# EAGLE board TEPIAmainboard (EAGLE 8.0.1), part 1 of 2
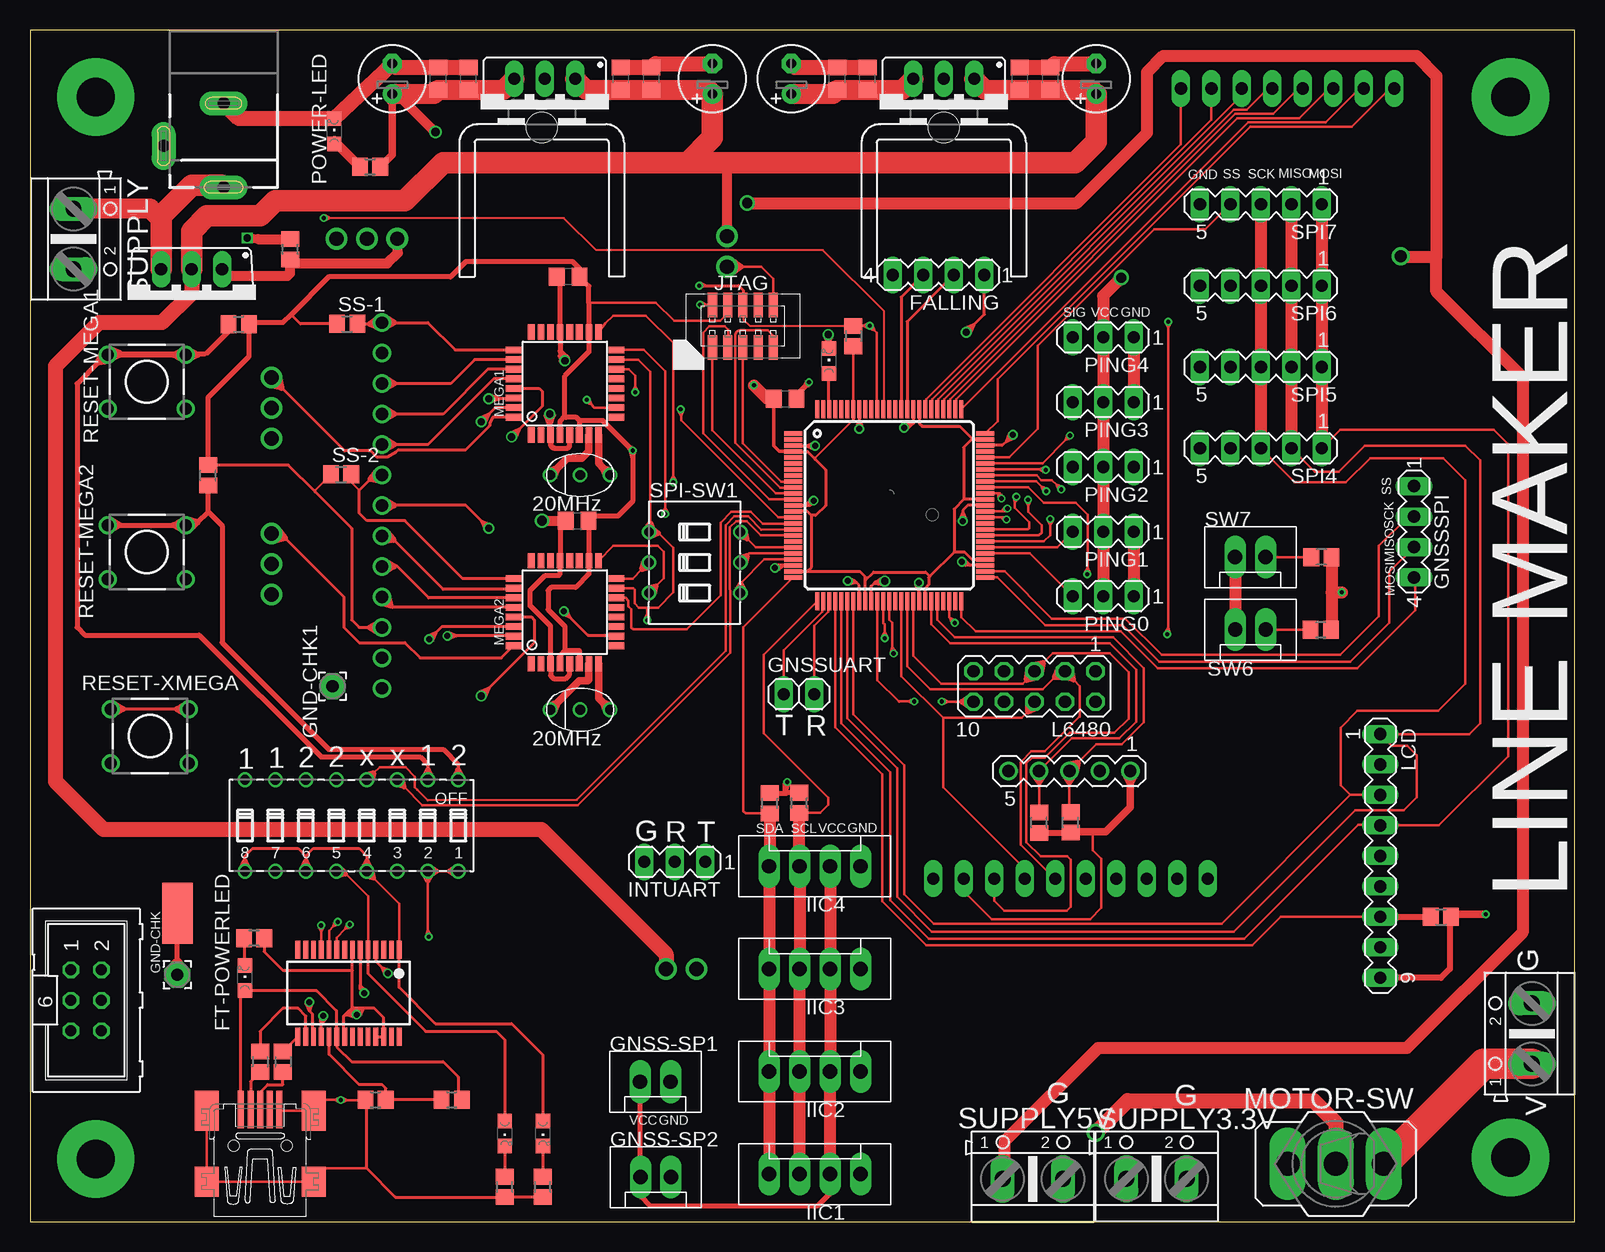
[diagram p5: board, top side]
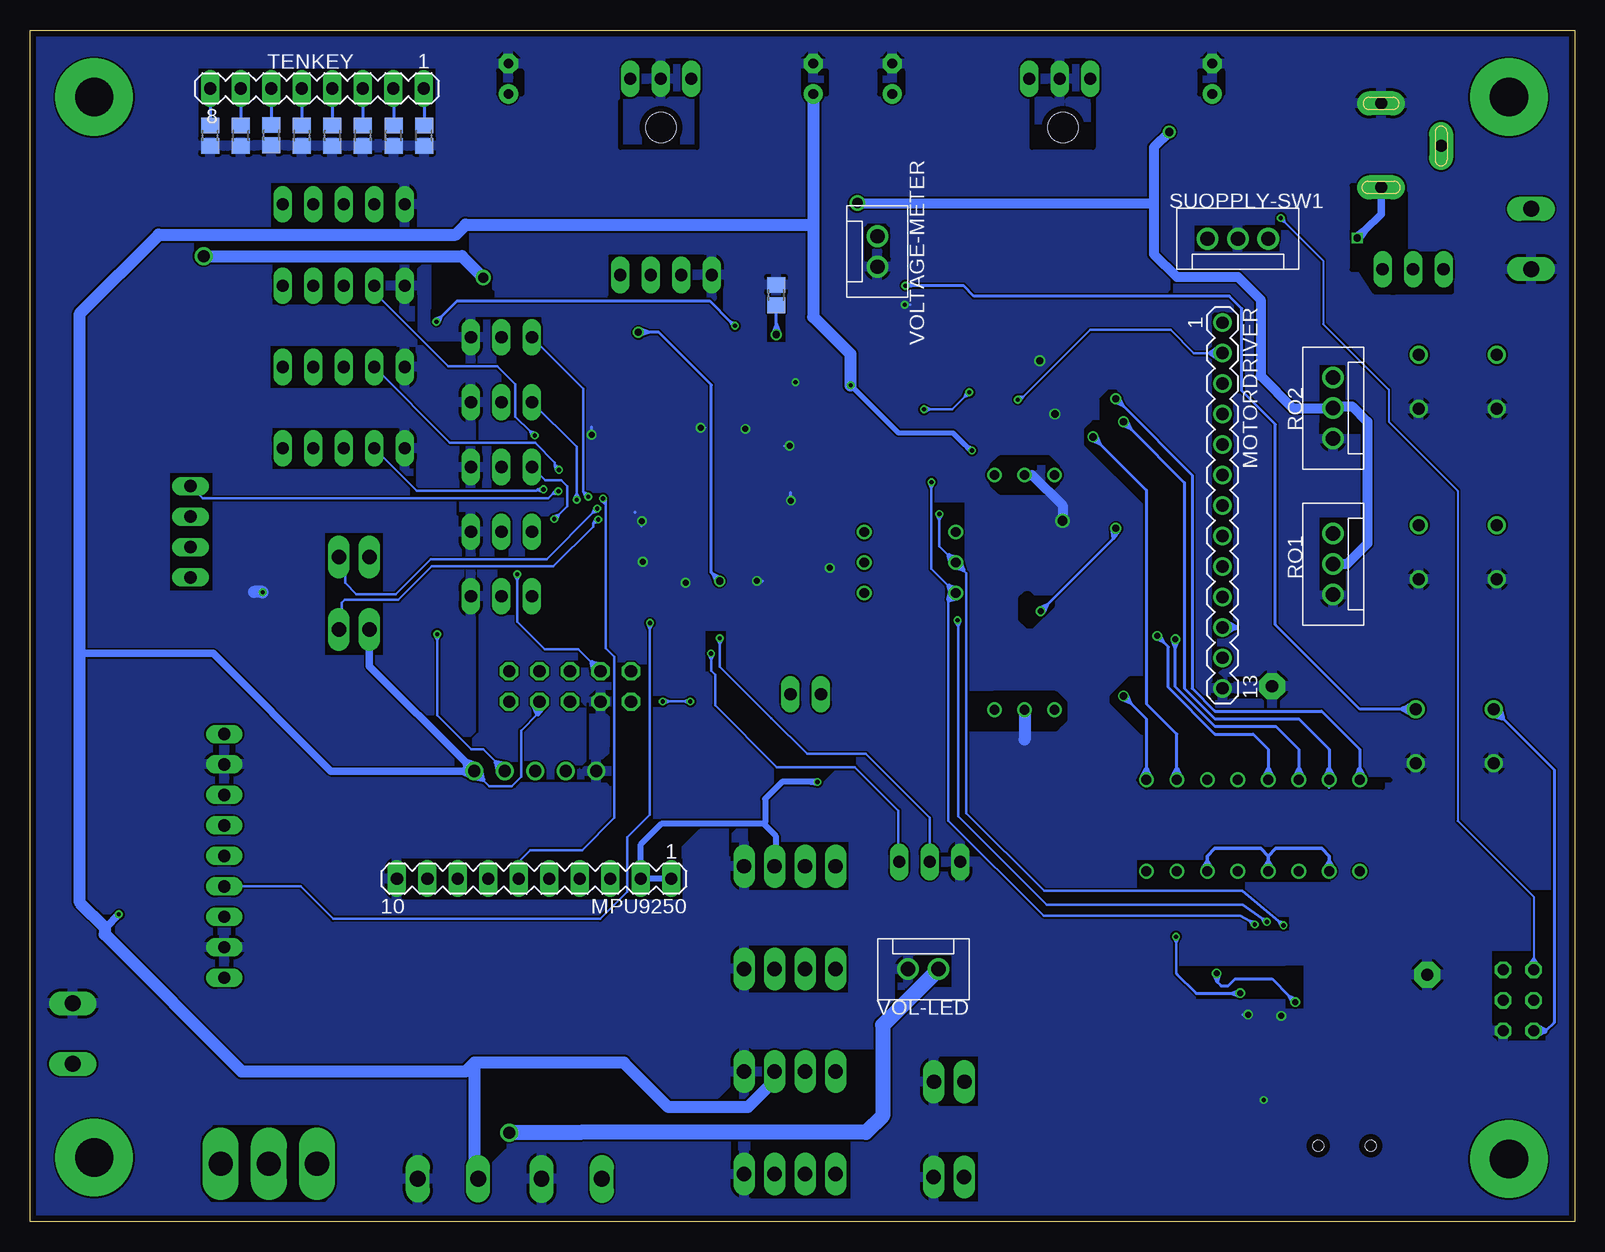
[diagram p6: board, bottom side, seen from below]

Size 128.72 x 99.31 mm. Coordinates in mm from the lower left corner, seen from the top.
Outline: 0,0 128.72,0 128.72,99.31 0,99.31 0,0
Copper layers (1*16): Top 0.035mm / dielectric 1.6mm / Bottom 0.035mm
Design rules "Elecrow_2-layer_PCB_eagle_rule": minimum track width 6mil, minimum drill 12mil, track to track 6mil, track to pad 6mil, pad to pad 6mil, via to via 8mil, smd to smd 0mil, copper to edge 20mil, drill to drill 10mil, minimum pad ring 6mil, minimum via ring 6mil, stop-mask expansion 0mil, vias tented up to drill 100mil, thermal gap 10mil
bRestrict: area 17.7,65.7 to 19.4,66.6; area 17.7,65.7 to 21.3,66.6; area 19.2,66.7 to 21.2,71.2; area 19.2,71.2 to 21.2,71.3; area 19.1,68.4 to 19.4,71.3; area 19.2,70.9 to 21.2,71.4; area 22.6,17.8 to 24.1,21.3; area 20.3,28.3 to 30.7,30.5; area 28.7,80.9 to 31.7,83; area 24.6,80.9 to 27.5,83.1; area 24.4,43.7 to 24.9,45.2; area 26.4,45.1 to 28.6,45.4; 33 more areas; 173 lines

## Footprints (pad centres in the part's own frame; a part is rotated, then mirrored left to right if it is on the bottom)
E2,5-6 = drill 0.813 pad 1.6: + -1.27,0 | drill 0.813 pad 1.6 octagon: - 1.27,0
C0805 = smd 1.3 x 1.5: 1 -0.95,0; 2 0.95,0
78XXS = drill 1.016 long: GND 0,-2.54; IN -2.54,-2.54; OUT 2.54,-2.54
MA04-1 = drill 1.016 long: 1 -3.81,0; 2 -1.27,0; 3 1.27,0; 4 3.81,0
R0805 = smd 1.3 x 1.5: 1 -0.85,0; 2 0.85,0
32005-201 = smd 3.1 x 0.5: 1 3,1.6; 2 3,0.8; 3 3,0; 4 3,-0.8; 5 3,-1.6 | smd 2.5 x 2: M1 -3,-4.45; M2 -3,4.45 | smd 3.3 x 2: M3 2.9,4.45; M4 2.9,-4.45 | hole 0.9: 0,2.2; 0,-2.2
CHIPLED_0805 = smd 1.2 x 1.2: A 0,-1.05; C 0,1.05
2,15/1,0 = drill 1.016 pad 2.159 octagon: 1 0,0
CON2 = drill 1.2 long: P$1 -1.27,0; P$2 1.27,0
1X02 = drill 1.016 long: 1 -1.27,0; 2 1.27,0
SSOP28 = smd 0.4 x 1.5: 1 -4.225,-3.625; 2 -3.575,-3.625; 3 -2.925,-3.625; 4 -2.275,-3.625; 5 -1.625,-3.625; 6 -0.975,-3.625; 7 -0.325,-3.625; 8 0.325,-3.625; 9 0.975,-3.625; 10 1.625,-3.625; 11 2.275,-3.625; 12 2.925,-3.625; 13 3.575,-3.625; 14 4.225,-3.625; 15 4.225,3.625; 16 3.575,3.625; 17 2.925,3.625; 18 2.275,3.625; 19 1.625,3.625; 20 0.975,3.625; 21 0.325,3.625; 22 -0.325,3.625; 23 -0.975,3.625; 24 -1.625,3.625; 25 -2.275,3.625; 26 -2.925,3.625; 27 -3.575,3.625; 28 -4.225,3.625
CON4 = drill 1.2 long: P$1 -3.81,0; P$2 -1.27,0; P$3 1.27,0; P$4 3.81,0
MA03-1 = drill 1.016 long: 1 -2.54,0; 2 0,0; 3 2.54,0
20021221-00010C4LF = smd 0.76 x 2.05: 1 -2.54,-1.78; 2 -2.54,1.78; 3 -1.27,-1.78; 4 -1.27,1.78; 5 0,-1.78; 6 0,1.78; 7 1.27,-1.78; 8 1.27,1.78; 9 2.54,-1.78; 10 2.54,1.78
D01PA = hole 2.54: 0,-1.016
MA05-2 = drill 1.016 octagon: 1 -5.08,-1.27; 2 -5.08,1.27; 3 -2.54,-1.27; 4 -2.54,1.27; 5 0,-1.27; 6 0,1.27; 7 2.54,-1.27; 8 2.54,1.27; 9 5.08,-1.27; 10 5.08,1.27
MA09-1 = drill 1.016 long: 1 -10.16,0; 2 -7.62,0; 3 -5.08,0; 4 -2.54,0; 5 0,0; 6 2.54,0; 7 5.08,0; 8 7.62,0; 9 10.16,0
MA05-1 = drill 1.016: 1 -5.08,0; 2 -2.54,0; 3 0,0; 4 2.54,0; 5 5.08,0
TQFP32-08 = smd 1.27 x 0.559: 1 -4.293,2.8; 2 -4.293,2; 3 -4.293,1.2; 4 -4.293,0.4; 5 -4.293,-0.4; 6 -4.293,-1.2; 7 -4.293,-2; 8 -4.293,-2.8; 17 4.293,-2.8; 18 4.293,-2; 19 4.293,-1.2; 20 4.293,-0.4; 21 4.293,0.4; 22 4.293,1.2; 23 4.293,2; 24 4.293,2.8 | smd 0.559 x 1.27: 9 -2.8,-4.293; 10 -2,-4.293; 11 -1.2,-4.293; 12 -0.4,-4.293; 13 0.4,-4.293; 14 1.2,-4.293; 15 2,-4.293; 16 2.8,-4.293; 25 2.8,4.293; 26 2,4.293; 27 1.2,4.293; 28 0.4,4.293; 29 -0.4,4.293; 30 -1.2,4.293; 31 -2,4.293; 32 -2.8,4.293
AK500/2 = drill 1.321 long: 1 -2.515,0; 2 2.515,0
320-916 = drill 2.007 long: 1 0,4.013; 2 0,0; 3 0,-4.013
MA13-1 = drill 1.016: 1 -15.24,0; 2 -12.7,0; 3 -10.16,0; 4 -7.62,0; 5 -5.08,0; 6 -2.54,0; 7 0,0; 8 2.54,0; 9 5.08,0; 10 7.62,0; 11 10.16,0; 12 12.7,0; 13 15.24,0
MA10-1 = drill 1.016 long: 1 -11.43,0; 2 -8.89,0; 3 -6.35,0; 4 -3.81,0; 5 -1.27,0; 6 1.27,0; 7 3.81,0; 8 6.35,0; 9 8.89,0; 10 11.43,0
SMD2,54-5,08 = smd 2.54 x 5.08: 1 0,0
CSTLS_X = drill 0.813: 1 -2.5,0; 2 0,0; 3 2.5,0
TO220BV = drill 1.016 long: D 0,-2.54; G -2.54,-2.54; S 2.54,-2.54
DTS-6 = drill 1: 1 -3.25,2.25; 2 3.25,2.25; 3 -3.25,-2.25; 4 3.25,-2.25
CON3 = drill 1.2: P$1 -2.54,0; P$2 0,0; P$3 2.54,0
DIP08S = drill 0.813: 1 -8.89,-3.81; 2 -6.35,-3.81; 3 -3.81,-3.81; 4 -1.27,-3.81; 5 1.27,-3.81; 6 3.81,-3.81; 7 6.35,-3.81; 8 8.89,-3.81; 9 8.89,3.81; 10 6.35,3.81; 11 3.81,3.81; 12 1.27,3.81; 13 -1.27,3.81; 14 -3.81,3.81; 15 -6.35,3.81; 16 -8.89,3.81
MA05-1' = drill 1.016 long: 1 -5.08,0; 2 -2.54,0; 3 0,0; 4 2.54,0; 5 5.08,0
DIP03YL = drill 0.813: 1 -2.54,-3.81; 2 0,-3.81; 3 2.54,-3.81; 4 2.54,3.81; 5 0,3.81; 6 -2.54,3.81
ML6 = drill 0.914 octagon: 1 -2.54,-1.27; 2 -2.54,1.27; 3 0,-1.27; 4 0,1.27; 5 2.54,-1.27; 6 2.54,1.27
MA08-1 = drill 1.016 long: 1 -8.89,0; 2 -6.35,0; 3 -3.81,0; 4 -1.27,0; 5 1.27,0; 6 3.81,0; 7 6.35,0; 8 8.89,0
TQFP-100A-100 = smd 1.5 x 0.35: 1 -8,6; 2 -8,5.5; 3 -8,5; 4 -8,4.5; 5 -8,4; 6 -8,3.5; 7 -8,3; 8 -8,2.5; 9 -8,2; 10 -8,1.5; 11 -8,1; 12 -8,0.5; 13 -8,0; 14 -8,-0.5; 15 -8,-1; 16 -8,-1.5; 17 -8,-2; 18 -8,-2.5; 19 -8,-3; 20 -8,-3.5; 21 -8,-4; 22 -8,-4.5; 23 -8,-5; 24 -8,-5.5; 25 -8,-6; 51 8,-6; 52 8,-5.5; 53 8,-5; 54 8,-4.5; 55 8,-4; 56 8,-3.5; 57 8,-3; 58 8,-2.5; 59 8,-2; 60 8,-1.5; 61 8,-1; 62 8,-0.5; 63 8,0; 64 8,0.5; 65 8,1; 66 8,1.5; 67 8,2; 68 8,2.5; 69 8,3; 70 8,3.5; 71 8,4; 72 8,4.5; 73 8,5; 74 8,5.5; 75 8,6 | smd 0.35 x 1.5: 26 -6,-8; 27 -5.5,-8; 28 -5,-8; 29 -4.5,-8; 30 -4,-8; 31 -3.5,-8; 32 -3,-8; 33 -2.5,-8; 34 -2,-8; 35 -1.5,-8; 36 -1,-8; 37 -0.5,-8; 38 0,-8; 39 0.5,-8; 40 1,-8; 41 1.5,-8; 42 2,-8; 43 2.5,-8; 44 3,-8; 45 3.5,-8; 46 4,-8; 47 4.5,-8; 48 5,-8; 49 5.5,-8; 50 6,-8; 76 6,8; 77 5.5,8; 78 5,8; 79 4.5,8; 80 4,8; 81 3.5,8; 82 3,8; 83 2.5,8; 84 2,8; 85 1.5,8; 86 1,8; 87 0.5,8; 88 0,8; 89 -0.5,8; 90 -1,8; 91 -1.5,8; 92 -2,8; 93 -2.5,8; 94 -3,8; 95 -3.5,8; 96 -4,8; 97 -4.5,8; 98 -5,8; 99 -5.5,8; 100 -6,8
CON2' = drill 1.2: P$1 -1.27,0; P$2 1.27,0
MJ-179P = drill 1 pad 2 long: 1 3,0; 2 -4,0; 3 -0.45,-5

## Placement (x,y rotation side)
3.3C1  100u  [E2,5-6]  88.85,95.25 90 top
3.3C2  0.1u  [C0805]  85.04,95.25 90 top
3.3C3  0.1u  [C0805]  82.5,95.25 90 top
3.3C4  0.1u  [C0805]  69.8,95.25 90 top
3.3C5  0.1u  [C0805]  67.26,95.25 90 top
3.3C6  100u  [E2,5-6]  63.45,95.25 90 top
3.3V-REGU  [78XXS]  76.15,92.71 180 top
5C11  100u  [E2,5-6]  56.87,95.25 90 top
5C12  0.1u  [C0805]  51.79,95.25 90 top
5C13  0.1u  [C0805]  49.25,95.25 90 top
5C14  0.1u  [C0805]  36.55,95.25 90 top
5C15  0.1u  [C0805]  34.01,95.25 90 top
5C16  100u  [E2,5-6]  30.2,95.25 90 top
5V-REGU  [78XXS]  42.9,92.71 180 top
FALLING  [MA04-1]  75.71,78.9 180 top
FT232-R1  4.7K  [R0805]  35.15,10.16 0 top
FT232-R2  10K  [R0805]  28.8,10.16 0 top
FT232-R3  1K  [R0805]  18.67,23.62 180 top
FT232-R4  330  [R0805]  39.56,2.9 90 top
FT232-R5  330  [R0805]  42.74,2.9 90 top
FT232-R6  23  [R0805]  21.08,13.34 270 top
FT232-R7  23  [R0805]  19.18,13.34 270 top
FT232USBCON  Wrie-USB  [32005-201]  19.18,6.35 90 top
FT-POWERLED  [CHIPLED_0805]  17.91,20.32 0 top
GND-CHK  [2,15/1,0]  12.27,20.59 0 top
GND-CHK1  [2,15/1,0]  25.21,44.62 0 top
GNSS-SP1  XH-2  [CON2]  52.11,11.67 0 top
GNSS-SP2  XH-2  [CON2]  52.15,3.71 0 top
GNSSSPI  [MA04-1]  115.34,57.5 270 top
GNSSUART  [1X02]  64.08,43.96 0 top
IC5  FT232RL  [SSOP28]  26.54,19.05 180 top
IIC1  XH-4  [CON4]  65.4,3.97 180 top
IIC2  XH-4  [CON4]  65.4,12.52 180 top
IIC3  XH-4  [CON4]  65.4,21.08 180 top
IIC4  XH-4  [CON4]  65.4,29.63 180 top
IIC-UP1  1K  [R0805]  84.09,33.26 90 top
IIC-UP2  1K  [R0805]  86.71,33.28 90 top
IIC_D-R  4.7K  [R0805]  61.64,34.87 90 top
IIC_D-R2  4.7K  [R0805]  64.1,34.9 90 top
INTUART  [MA03-1]  53.74,29.99 180 top
JTAG  [20021221-00010C4LF]  59.41,74.63 0 top
K  4.7K  [R0805]  95.88,90.51 90 bottom
K0  4.7K  [R0805]  113.7,90.51 90 bottom
K1  4.7K  [R0805]  111.14,90.51 90 bottom
K2  4.7K  [R0805]  108.6,90.56 90 bottom
K3  4.7K  [R0805]  106.06,90.51 90 bottom
K4  4.7K  [R0805]  103.51,90.51 90 bottom
K5  4.7K  [R0805]  100.97,90.51 90 bottom
K6  4.7K  [R0805]  98.42,90.51 90 bottom
KK1  D01PA  [D01PA]  76.15,90.19 180 top
KK2  D01PA  [D01PA]  42.64,90.19 180 top
L1  RXDLED  [CHIPLED_0805]  39.56,7.35 180 top
L2  TXDLED  [CHIPLED_0805]  42.74,7.35 180 top
L6  TESTLED  [CHIPLED_0805]  66.57,71.73 0 top
L6480  [MA05-2]  83.71,44.61 180 top
LCD  [MA09-1]  112.52,30.49 270 top
LCD-I2C  LCD-I2C  [MA05-1]  86.62,37.56 180 top
M1-R1  4.7K  [R0805]  14.84,62.2 90 top
M2-R1  4.7K  [R0805]  17.4,74.8 0 top
M2-R2  4.7K  [R0805]  21.69,81.05 90 top
MEGA1  [TQFP32-08]  44.58,69.85 90 top
MEGA1-C1  0.1u  [C0805]  45.59,58.42 0 top
MEGA2  [TQFP32-08]  44.58,50.8 90 top
MEGA2-C1  0.1u  [C0805]  44.85,78.74 180 top
MOTOR-SUPPLY  MOTOR  [AK500/2]  125.16,15.68 90 top
MOTOR-SW  [320-916]  108.81,4.84 90 top
MOTORDRIVER  [MA13-1]  29.34,59.69 270 bottom
MPU9250  [MA10-1]  86.71,28.59 180 bottom
PAD2  [SMD2,54-5,08]  12.29,25.7 0 top
PING0  [MA03-1]  89.43,52.13 180 top
PING1  [MA03-1]  89.43,57.49 180 top
PING2  [MA03-1]  89.43,62.9 180 top
PING3  [MA03-1]  89.43,68.3 180 top
PING4  [MA03-1]  89.43,73.7 180 top
POWER-LED  [CHIPLED_0805]  25.36,90.87 0 top
POWER-LEDR  1K  [R0805]  28.34,87.92 0 top
Q1  20MHz  [CSTLS_X]  45.85,62.23 0 top
Q2  20MHz  [CSTLS_X]  45.85,42.67 0 top
Q3  IRF9530  [TO220BV]  13.46,76.83 180 top
RESET-MEGA1  R-2  [DTS-6]  9.73,70 0 top
RESET-MEGA2  R-1  [DTS-6]  9.73,55.8 0 top
RESET-XMEGA  DTS-6  [DTS-6]  9.99,40.47 0 top
RO1  XH-3  [CON3]  20.13,54.8 90 bottom
RO2  XH-3  [CON3]  20.13,67.8 90 bottom
S1  [DIP08S]  26.8,33.02 180 top
SPI4  [MA05-1']  102.58,64.46 180 top
SPI5  [MA05-1']  102.58,71.23 180 top
SPI6  [MA05-1']  102.58,78.01 180 top
SPI7  [MA05-1']  102.58,84.79 180 top
SPI-SW1  [DIP03YL]  55.38,54.93 270 top
SS-1  10K  [R0805]  26.43,74.82 0 top
SS-2  10K  [R0805]  25.92,62.27 0 top
SS-3  10K  [R0805]  117.58,25.41 0 top
SUOPPLY-SW1  XH-3  [CON3]  28.07,81.92 0 bottom
SUPPLY  MAIN  [AK500/2]  3.63,81.9 270 top
SUPPLY3.3V  MAIN  [AK500/2]  93.88,3.58 0 top
SUPPLY5V  MAIN  [AK500/2]  83.57,3.58 0 top
SV3  [ML6]  4.69,18.46 270 top
SW6  XH-2  [CON2]  101.71,49.34 0 top
SW6-R  4.7K  [R0805]  107.57,49.32 180 top
SW7  XH-2  [CON2]  101.7,55.39 0 top
SW7-R  4.7K  [R0805]  107.62,55.39 180 top
TENKEY  [MA08-1]  104.8,94.44 180 bottom
TEST-R  330  [R0805]  66.55,77.23 270 bottom
U1  [TQFP-100A-100]  71.6,59.69 0 top
VOL-LED  XH-2  [CON2']  54.28,21.05 180 bottom
VOLTAGE-METER  XH-2  [CON2']  58.1,80.85 270 bottom
X1  DCJACK-MJ179P  [MJ-179P]  16.13,89.2 270 top
X-R1  4.7K  [R0805]  68.62,73.81 270 top
XMEGA-C1  0.1u  [C0805]  62.93,68.59 0 top

## Tracks (layer width: path | path; a pad name or v marks a point on that pad's centre or on a via)
+3V3  (via drill 0.35)
  Top 0.2: 68.6,66.82 65.43,63.65 65.43,63.53 | MPU9250.2 77.82,27.55 80.16,25.21 88.33,25.21 89.29,26.16 89.29,30.23 88.55,30.97 88.55,32.48 88.54,32.49 | X-R1.2 68.6,72.94 U1.94 | SS-2.1 23.76,60.97 23.76,60.82
  Top 0.203: JTAG.4 58.14,75.7 57.51,75.07 53.67,75.07 52.14,76.6 46.63,76.6 46.58,76.54
  Top 0.254: 46.58,58.39 arc90 MEGA1-C1.2 | 45.85,78.79 MEGA2-C1.1 45.8,79.42 | M1-R1.2 21.53,63.05 23.76,60.82 26.8,57.78 26.8,50.16 27.43,49.53 28.32,49.53 MOTORDRIVER.11 | MEGA1.6 45.85,65.63 | 44.18,47.23 MEGA2.4 | MEGA2.18 46.48,55 | U1.83 74.1,66.51 74.34,66.28 77.49,66.28 78.57,65.19 U1.74 78.46,65.19 77.8,64.53 77.8,60.19 | U1.94 68.6,66.82 | 77,55.8 77.88,55.8 78.5,55.19 U1.54 | 77,55.8 74.98,53.79 | 74.98,53.79 74.89,53.7 74.89,53.07 74.6,52.77 74.6,51.86 | 74.6,51.86 U1.44 | U1.64 77.8,60.19 | 77.8,60.19 77,59.39 77,55.8 | U1.34 69.61,51.7 69.61,53.44 | 69.61,53.44 70.3,54.13 74.64,54.13 74.98,53.79 | 69.61,53.44 69.61,53.75 69.18,54.18 63.61,54.18 U1.24 64.78,54.19 65.14,54.55 65.14,58.83 | 65.14,58.83 64.79,59.19 U1.14 | U1.4 63.62,64.17 64.8,64.17 | 64.8,64.17 65.43,63.53 66.29,62.67 66.29,59.68 65.47,58.86 65.14,58.86 65.14,58.83 | 64.8,64.17 64.79,64.16 | SS-1.1 22.53,74.82 21.75,75.6 | 74.62,51.84 74.6,51.86
  Top 0.305: 18.38,74.93 M2-R1.2 | XMEGA-C1.1 61.98,64.65 62.43,64.2 U1.4
  Top 0.406: MEGA2-C1.1 46.58,77.96 46.58,76.54 MEGA1.18 46.58,72.48 44.58,70.48 44.58,67.11 | 46.58,58.39 MEGA2.18 46.58,53.99 45.47,52.88 43.43,52.88 43.17,52.62 43.17,51.02 44.58,49.62 44.58,47.62 | 44.58,47.62 44.18,47.23 | M1-R1.2 14.84,68.69 18.25,72.1 M2-R1.2 | 18.38,74.93 21.08,74.93 21.75,75.6 24.89,78.74 35.05,78.74 36.32,80.01 45.21,80.01 45.8,79.42 | MEGA2.6 45.78,47.58 45.73,47.62 44.58,47.62 | MEGA1.4 44.18,66.71 44.58,67.11 | 45.78,66.79 MEGA1.6 | 45.78,66.79 45.53,67.04 44.65,67.04 44.58,67.11 | 45.78,66.79 47.7,66.79 49.85,64.64 | v50.22,64.27 49.85,64.64 | 46.9,58.78 46.92,58.8 48.98,58.8 50.22,60.03 50.22,63.74 | v50.22,64.27 50.22,63.74 | GNSS-SP1.P$1 50.84,3.75 GNSS-SP2.P$1 50.88,2.11 51.63,1.35 65.65,1.35 66.64,2.35 66.64,3.94 IIC1.P$2 | 89.52,32.38 89.63,32.49 | IIC_D-R.2 62.99,35.72 63.02,35.75 IIC_D-R2.2 | 49.85,64.64 50.12,64.2 v50.22,64.27 | 49.85,64.64 50.29,64.37 v50.22,64.27 | 50.22,63.74 50.34,64.24 v50.22,64.27 | 50.22,63.74 50.1,64.24 v50.22,64.27
  Top 0.508: 29.08,49.97 | 28.32,49.53 | 29.08,49.09 | 29.08,49.97 | 28.32,49.53 29.08,49.09 | 29.08,49.09 | SS-3.2 118.33,25.31 118.33,21.08 117.58,20.33 LCD.9 | IIC-UP1.1 84.11,32.43 IIC-UP2.1 | 64.07,35.72 IIC_D-R2.2 | 62.99,35.72 62.99,36.14 | 62.99,36.14 62.99,36.52 63.09,36.63 v63.09,36.65 | 50.82,3.72 50.84,3.75 | 62.99,36.14 63.16,36.63 v63.09,36.65 | 62.99,36.14 63.02,36.66 v63.09,36.65 | 29.08,49.09 | 28.32,49.53 | 28.32,49.53 29.08,49.09 | MOTORDRIVER.11 29.08,49.09 | 28.32,49.53 | 29.08,49.97 | MOTORDRIVER.11 29.08,49.97 | 28.32,49.53 | 28.32,49.53 29.08,49.09 | MOTORDRIVER.11 29.08,49.09 | 28.32,49.53 | 28.32,49.53 29.08,49.97 | MOTORDRIVER.11 29.08,49.97 | 28.32,49.53 29.08,49.09 | 28.32,49.53 29.08,49.09 | 29.08,49.09 | 28.32,49.53 29.08,49.09 | MOTORDRIVER.11 29.08,49.09 | 28.32,49.53 29.08,49.97 | 29.08,49.97 | MOTORDRIVER.11 29.08,49.97 | 28.32,49.53 29.08,49.09 | 28.32,49.53 29.08,49.97 | 28.32,49.53 29.08,49.09 | MOTORDRIVER.11 29.08,49.09 | 28.32,49.53 29.08,49.97 | MOTORDRIVER.11 29.08,49.97
  Top 0.61: 46.9,58.78 MEGA1-C1.2 | LCD-I2C.1 91.7,36.54 | 91.7,36.54 91.7,34.56 89.63,32.49 88.54,32.49 86.77,32.49 IIC-UP2.1 | v121.31,25.62 118.64,25.62 SS-3.2 | 91.7,36.54 92.1,37.35 LCD-I2C.1 | 91.7,36.54 91.29,37.35 LCD-I2C.1
  Top 1.016: IIC4.P$2 IIC3.P$2 IIC2.P$2 IIC1.P$2 | SW7.P$1 SW6.P$1 | v60.33,69.7 61.43,68.59 XMEGA-C1.1
  Top 1.676: 3.3V-REGU.OUT 72.66,94.3 3.3C4.1 3.3C5.1 66.94,93.98 3.3C6.+
  Bottom 0.2: LCD-I2C.1 90.98,36.84 90.45,36.31 88.56,36.31 87.8,37.07 87.8,40.93 86.39,42.33 86.25,42.47 L6480.4
  Bottom 0.254: 28.32,49.53 MOTORDRIVER.11
  Bottom 0.4: 86.39,42.33 86.76,43.09 L6480.4 85.83,42.97 86.39,42.33 | 90.98,36.84 91.81,37.01 LCD-I2C.1 91.15,37.67 90.98,36.84
  Bottom 0.406: v60.33,69.7 59.95,69.33 | 59.95,69.33 56.36,65.73 51.82,65.73 50.86,64.78 50.83,64.78 50.64,64.59 | 50.64,64.59 50.23,64.18 v50.23,64.26 v50.22,64.27 | 59.95,69.33 60.39,69.59 v60.33,69.7 | 59.95,69.33 60.22,69.76 v60.33,69.7 | 50.64,64.59 50.17,64.38 v50.22,64.27 | 50.64,64.59 50.32,64.19 v50.22,64.27
  Bottom 0.508: 29.08,49.97 | 28.32,49.53 | 29.08,49.09 | 29.08,49.97 | 28.32,49.53 29.08,49.09 | 29.08,49.09 | 67.58,33.17 76.1,33.17 77.82,31.45 MPU9250.2 MPU9250.1 | 67.58,33.17 66.58,32.16 66.58,29.72 IIC4.P$2 | v63.09,36.65 63.62,36.65 | 63.62,36.65 66.05,36.65 67.46,35.24 67.46,33.29 67.58,33.17 | 63.62,36.65 63.1,36.73 v63.09,36.65 | 63.62,36.65 63.1,36.58 v63.09,36.65 | 29.08,49.09 | 28.32,49.53 | 28.32,49.53 29.08,49.09 | MOTORDRIVER.11 29.08,49.09 | 28.32,49.53 | 29.08,49.97 | MOTORDRIVER.11 29.08,49.97 | 28.32,49.53 | 28.32,49.53 29.08,49.09 | MOTORDRIVER.11 29.08,49.09 | 28.32,49.53 | 28.32,49.53 29.08,49.97 | MOTORDRIVER.11 29.08,49.97 | 28.32,49.53 29.08,49.09 | 28.32,49.53 29.08,49.09 | 29.08,49.09 | 28.32,49.53 29.08,49.09 | MOTORDRIVER.11 29.08,49.09 | 28.32,49.53 29.08,49.97 | 29.08,49.97 | MOTORDRIVER.11 29.08,49.97 | 28.32,49.53 29.08,49.09 | 28.32,49.53 29.08,49.97 | 28.32,49.53 29.08,49.09 | MOTORDRIVER.11 29.08,49.09 | 28.32,49.53 29.08,49.97 | MOTORDRIVER.11 29.08,49.97
  Bottom 0.61: SW6.P$1 100.44,46.3 92.41,38.28 | 92.41,38.28 LCD-I2C.1 | 122.5,24.54 122.38,24.54 v121.31,25.62 | 124.56,47.37 113.46,47.37 103.65,37.56 92.71,37.56 | 92.71,37.56 LCD-I2C.1 | 92.41,38.28 91.55,37.99 LCD-I2C.1 | 92.41,38.28 92.13,37.42 LCD-I2C.1 | 92.71,37.56 91.9,37.97 LCD-I2C.1 | 92.71,37.56 91.9,37.15 LCD-I2C.1
  Bottom 1.016: 63.45,83.09 92.41,83.09 93.24,82.26 118,82.26 124.56,75.7 124.56,26.6 122.5,24.54 122.5,23.94 111.1,12.54 92.41,12.54 91.7,13.25 | SUPPLY3.3V.1 91.7,3.92 91.7,13.25 | IIC2.P$2 66.67,11.79 68.89,9.56 75.53,9.56 79.23,13.27 91.67,13.27 91.7,13.25 | v60.33,69.7 60.33,72.3 63.45,75.42 63.45,83.09 | 3.3C6.+ 63.45,83.09
+5V  (via drill 0.7, 0.85, 1)
  Top 0.61: 5C16.+ 30.2,93.17 | 30.2,93.17 | 30.2,93.17 30.2,88.92 POWER-LEDR.2 | 30.2,93.17 30.59,93.68 | 29.8,93.68 | 29.8,93.68 | 30.2,93.17 | 30.2,93.17 30.59,93.68 | 30.2,93.17 | 30.2,93.17 29.8,93.68 | 30.2,93.17 30.59,93.68 | 5C16.+ 30.59,93.68 | 30.2,93.17 | 30.2,93.17 29.8,93.68 | 5C16.+ 29.8,93.68 | 30.2,93.17 30.59,93.68 | 30.59,93.68 | 30.2,93.17 29.8,93.68 | 30.2,93.17 30.59,93.68 | 5C16.+ 30.59,93.68 | 30.2,93.17 29.8,93.68 | 29.8,93.68 | 5C16.+ 29.8,93.68 | 30.2,93.17 30.59,93.68 | 30.2,93.17 29.8,93.68 | 5C16.+ 29.8,93.68 | 30.2,93.17 30.59,93.68 | 5C16.+ 30.59,93.68 | 30.2,93.17 29.8,93.68 | 5C16.+ 29.8,93.68
  Top 0.813: 5C16.+ 30.61,93.98 v33.78,90.81
  Top 1.016: PING0.2 PING1.2 PING2.2 PING3.2 PING4.2 89.43,77.17 v90.94,78.68 | v59.77,84.89 87.22,84.89 93.09,90.77 93.09,95.79 94.46,97.16 115.53,97.16 117.2,95.48 117.2,80.38 | SUPPLY5V.1 81.2,3.71 81.2,6.66 89.01,14.46 114.74,14.46 124.38,24.11 124.38,70.33 117.2,77.5 117.2,80.38 | v114.25,80.47 114.34,80.38 117.2,80.38
  Top 1.676: 5V-REGU.OUT 39.41,94.3 5C14.1 5C15.1 33.69,93.98 5C16.+
  Bottom 0.813: RO2.P$2 20.27,67.94 | 30.61,93.98 5C16.+ | RO2.P$2 19.98,67.94 18.54,67.94 17.27,66.67 17.27,56.52 18.99,54.8 RO1.P$2 | RO2.P$2 23.48,67.8 26.16,70.48 26.16,76.83 28.07,78.74 33.15,78.74 35.05,80.64 35.05,84.89 | v33.78,90.81 35.05,89.53 35.05,84.89 | v59.77,84.89 35.05,84.89
  Bottom 1.016: v114.25,80.47 92.73,80.47 v90.94,78.68
+9V  (via drill 1)
  Top 0.813: VOLTAGE-METER.P$1 58.1,88.27 58.38,88.27
  Top 1.27: Q3.D 13.46,77.39 11,74.93 5.75,74.93 2.12,71.3 2.12,36.7 6.11,32.71 42.61,32.71 53.01,22.31 VOL-LED.P$1 | v88.8,7.43 91.46,10.1 106.98,10.1 108.83,8.25 108.83,4.86 MOTOR-SW.2
  Top 1.676: 3.3C1.+ 88.53,94.3 3.3C2.1 3.3C3.1 79.64,94.3 3.3V-REGU.IN | 5C11.+ 56.55,94.3 5C12.1 5C13.1 46.39,94.3 5V-REGU.IN
  Top 1.778: 3.3C1.+ 88.85,89.99 87.12,88.27 58.38,88.27 54.8,88.27 | 54.8,88.27 34.42,88.27 31.24,85.09 20.45,85.09 19.18,83.82 14.73,83.82 13.46,82.55 Q3.D | 5C11.+ 56.87,90.33 54.8,88.27
  Bottom 1.27: VOL-LED.P$1 57.67,16.39 57.67,8.8 59.03,7.44 82.82,7.44 82.84,7.43 v88.8,7.43
CS_1  (via drill 0.35)
  Top 0.2: U1.65 80.66,60.7 | 80.66,60.7 80.82,60.7 80.96,60.55 v80.96,60.27 | 80.66,60.7 80.74,60.23 v80.96,60.27 | 80.66,60.7 81.07,60.47 v80.96,60.27
  Bottom 0.2: v80.96,60.27 80.73,60.04 80.73,59.8 | MPU9250.6 88,28.61 88,30.01 87.04,30.97 82.71,30.97 80.03,33.66 80.03,47.08 80.73,47.78 80.73,59.8 | 80.73,59.8 81.1,60.09 v80.96,60.27 | 80.73,59.8 80.73,60.28 v80.96,60.27
CS_2  (via drill 0.35)
  Top 0.2: U1.66 83.18,61.19 84.46,59.91 87.13,59.91 88.13,58.9 88.13,54.49 | 88.13,54.49 88.13,54.12 v88.11,53.97 | 88.13,54.49 87.91,54.08 v88.11,53.97 | 88.13,54.49 88.32,54.06 v88.11,53.97
  Bottom 0.2: v88.11,53.97 88.11,53.44 | 88.11,53.44 88.11,50.01 85.83,47.73 83.02,47.73 81.89,46.6 L6480.7 | 88.11,53.44 88.32,53.87 v88.11,53.97 | 88.11,53.44 87.91,53.87 v88.11,53.97
  Bottom 0.4: 81.89,46.6 81.06,46.43 L6480.7 81.72,45.77 81.89,46.6
CS_3  (via drill 0.35)
  Top 0.2: v84.68,60.87 84.31,61.24 | 84.31,61.24 83.86,61.69 U1.67 | 84.31,61.24 84.47,60.79 v84.68,60.87 | 84.31,61.24 84.76,61.08 v84.68,60.87
  Bottom 0.2: GNSSSPI.1 114.34,60.31 85.52,60.31 85.17,60.66 | 85.17,60.66 84.97,60.87 v84.68,60.87 | 85.17,60.66 84.85,61.02 v84.68,60.87 | 85.17,60.66 84.7,60.64 v84.68,60.87
CS_4  (via drill 0.35)
  Top 0.2: v85.93,61.03 85.56,61.4 | 85.56,61.4 85.17,61.79 84.29,61.79 83.89,62.19 U1.68 | 85.56,61.4 85.71,60.95 v85.93,61.03 | 85.56,61.4 86,61.24 v85.93,61.03
  Bottom 0.2: SPI4.4 96.48,60.9 86.52,60.9 86.45,60.97 | 86.45,60.97 86.39,61.03 v85.93,61.03 | 86.45,60.97 86.05,61.22 v85.93,61.03 | 86.45,60.97 86,60.81 v85.93,61.03
CS_5  (via drill 0.35)
  Top 0.2: v84.64,62.66 84.6,62.69 84.11,62.69 | 84.11,62.69 U1.69 | 84.11,62.69 84.53,62.46 v84.64,62.66 | 84.11,62.69 84.55,62.87 v84.64,62.66
  Bottom 0.2: SPI5.4 93.73,64.92 86.63,64.92 84.98,63.27 84.98,63.06 | 84.98,63.06 84.98,62.96 84.67,62.66 v84.64,62.66 | 84.98,63.06 84.55,62.86 v84.64,62.66 | 84.98,63.06 84.86,62.6 v84.64,62.66
CS_6  (via drill 0.35)
  Top 0.2: v86.66,65.53 86.3,65.15 | 86.3,65.15 84.39,63.19 U1.70 | 86.3,65.15 86.74,65.31 v86.66,65.53 | 86.3,65.15 86.45,65.6 v86.66,65.53
  Bottom 0.2: SPI6.4 100.04,77.45 93.86,71.27 89.78,71.27 88.3,69.79 88.3,67.1 87.04,65.89 | 87.04,65.89 v86.66,65.53 | 87.04,65.89 86.59,65.74 v86.66,65.53 | 87.04,65.89 86.88,65.45 v86.66,65.53
CS_7
  Top 0.2: U1.71 81.61,63.7 83.99,66.08 83.99,73.02 93.67,82.7 97.95,82.7 SPI7.4
D_/RST  (via drill 0.35)
  Top 0.2: U1.48 76.6,50.36 76.68,50.28 | 76.68,50.28 v77.05,49.91 | 76.68,50.28 76.84,49.83 v77.05,49.91 | 76.68,50.28 77.13,50.12 v77.05,49.91
  Bottom 0.2: v77.05,49.91 77.05,49.38 | 77.05,49.38 77.05,33.93 78.93,32.05 78.93,27.5 81.2,25.23 103.47,25.23 106.17,27.94 LCD.6 | 77.05,49.38 77.26,49.81 v77.05,49.91 | 77.05,49.38 76.85,49.81 v77.05,49.91
FT232-RXD
  Top 0.2: S1.12 26.09,29.21 26.31,28.99 28.17,27.13 28.17,22.73 28.14,22.7
  Top 0.254: L1.A 39.56,15.18 38.86,15.88 32.97,15.88 28.17,20.68 IC5.5 28.14,22.7
  Top 0.4: 26.31,28.99 25.82,29.5 S1.12 25.63,28.81 26.31,28.99
  Bottom 0.254: 20.07,28.95
  Bottom 0.305: S1.10 20.45,30.02 | 20.45,30.02 | 20.45,30.02 20.45,30.48 21.08,31.11 24.89,31.11 25.53,30.48 | S1.14 30.61,30.02 | 30.61,30.02 | 30.61,30.02 30.61,30.48 29.97,31.11 26.16,31.11 25.53,30.48 | 25.53,30.48 25.53,30.02 | 25.53,30.02 | 25.53,30.02 S1.12 | S1.10 20.07,28.95 | 30.61,30.02 30.23,29.47 | 25.53,30.02 25.15,29.47 | S1.10 20.82,28.95 | 20.45,30.02 20.07,29.47 | 20.07,28.95 | S1.10 20.82,28.95 | S1.10 20.07,28.95 | S1.10 20.07,28.95 | S1.10 20.82,28.95 | S1.10 20.07,28.95 | 30.61,30.02 30.98,29.47 | 30.23,29.47 | 30.61,30.02 | 30.61,30.02 30.23,29.47 | S1.14 30.23,29.47 | 30.61,30.02 30.98,29.47 | 30.61,30.02 | 30.61,30.02 30.23,29.47 | 30.61,30.02 | 30.61,30.02 30.98,29.47 | S1.14 30.98,29.47 | 30.61,30.02 30.23,29.47 | 30.23,29.47 | 30.61,30.02 30.23,29.47 | S1.14 30.23,29.47 | 30.61,30.02 30.98,29.47 | S1.14 30.98,29.47 | 30.61,30.02 30.23,29.47 | S1.14 30.23,29.47 | 30.61,30.02 30.23,29.47 | 30.61,30.02 30.98,29.47 | 30.61,30.02 30.23,29.47 | S1.14 30.23,29.47 | 30.61,30.02 30.98,29.47 | S1.14 30.98,29.47 | 25.53,30.02 25.9,29.47 | 25.15,29.47 | 25.53,30.02 | 25.53,30.02 25.15,29.47 | S1.12 25.15,29.47 | 25.53,30.02 25.9,29.47 | 25.53,30.02 | 25.53,30.02 25.15,29.47 | 25.53,30.02 | 25.53,30.02 25.9,29.47 | S1.12 25.9,29.47 | 25.53,30.02 25.15,29.47 | 25.15,29.47 | 25.53,30.02 25.15,29.47 | S1.12 25.15,29.47 | 25.53,30.02 25.9,29.47 | S1.12 25.9,29.47 | 25.53,30.02 25.15,29.47 | S1.12 25.15,29.47 | 25.53,30.02 25.15,29.47 | 25.53,30.02 25.9,29.47 | 25.53,30.02 25.15,29.47 | S1.12 25.15,29.47 | 25.53,30.02 25.9,29.47 | S1.12 25.9,29.47 | 20.45,30.02 20.82,29.47 | 20.07,29.47 | 20.45,30.02 | 20.45,30.02 20.07,29.47 | S1.10 20.07,29.47 | 20.45,30.02 20.82,29.47 | 20.45,30.02 | 20.45,30.02 20.07,29.47
  Bottom 0.305: 20.45,30.02 | 20.45,30.02 20.82,29.47 | S1.10 20.82,29.47 | 20.45,30.02 20.07,29.47 | 20.07,29.47 | 20.45,30.02 20.07,29.47 | S1.10 20.07,29.47 | 20.45,30.02 20.82,29.47 | S1.10 20.82,29.47 | 20.45,30.02 20.07,29.47 | S1.10 20.07,29.47 | 20.45,30.02 20.07,29.47 | 20.45,30.02 20.82,29.47 | 20.45,30.02 20.07,29.47 | S1.10 20.07,29.47 | 20.45,30.02 20.82,29.47 | S1.10 20.82,29.47
  Bottom 0.508: 20.13,29.05 | S1.10 20.13,29.05 | 20.77,29.05 | S1.10 20.77,29.05 | 20.13,29.05 | S1.10 20.13,29.05 | 20.13,29.05 | 20.77,29.05 | S1.10 20.77,29.05 | S1.10 20.13,29.05 | S1.10 20.77,29.05 | S1.10 20.13,29.05
FT232-TXD
  Top 0.2: IC5.1 30.77,26.51 28.64,28.64 S1.13
  Top 0.254: IC5.1 30.77,19.52 33.78,16.51 40.13,16.51 42.74,13.91 L2.A | 17.91,29.84 S1.9 17.91,30.02 17.91,30.48 18.54,31.11 22.35,31.11 22.99,30.48 | 22.99,30.48 22.99,30.02 S1.11 | 22.99,30.48 23.62,31.11 27.43,31.11 28.07,30.48 28.07,30.02 S1.13
  Top 0.4: 28.64,28.64 28.46,29.31 S1.13 27.96,28.81 28.64,28.64
  Top 0.508: 17.59,29.37 | 17.59,29.37 | S1.9 17.59,29.37 | 22.67,29.37 | 22.67,29.37 | S1.11 22.67,29.37 | 27.75,29.37 | 27.75,29.37 | S1.13 27.75,29.37 | 17.91,30.02 17.59,29.37 | 22.99,30.02 22.67,29.37 | 28.07,30.02 27.75,29.37 | 17.91,30.02 17.59,29.37 | 17.91,30.02 18.23,29.37 | 17.59,29.37 | 22.99,30.02 22.67,29.37 | 22.99,30.02 23.31,29.37 | 22.67,29.37 | 28.07,30.02 27.75,29.37 | 28.07,30.02 28.39,29.37 | 27.75,29.37 | 17.91,30.02 | 17.91,30.02 17.59,29.37 | S1.9 17.59,29.37 | 17.91,30.02 | 17.91,30.02 18.23,29.37 | 18.23,29.37 | 17.91,30.02 | 17.91,30.02 | 17.91,30.02 18.23,29.37 | S1.9 18.23,29.37 | 17.91,30.02 17.59,29.37 | 17.91,30.02 17.59,29.37 | 17.59,29.37 | 17.91,30.02 17.59,29.37 | S1.9 17.59,29.37 | 17.91,30.02 18.23,29.37 | 18.23,29.37 | S1.9 18.23,29.37 | 17.91,30.02 17.59,29.37 | 17.91,30.02 18.23,29.37 | 17.91,30.02 17.59,29.37 | S1.9 17.59,29.37 | 17.91,30.02 18.23,29.37 | S1.9 18.23,29.37 | 22.99,30.02 | 22.99,30.02 22.67,29.37 | S1.11 22.67,29.37 | 22.99,30.02 | 22.99,30.02 23.31,29.37 | 23.31,29.37 | 22.99,30.02 | 22.99,30.02 | 22.99,30.02 23.31,29.37 | S1.11 23.31,29.37 | 22.99,30.02 22.67,29.37 | 22.99,30.02 22.67,29.37 | 22.67,29.37 | 22.99,30.02 22.67,29.37 | S1.11 22.67,29.37 | 22.99,30.02 23.31,29.37 | 23.31,29.37 | S1.11 23.31,29.37 | 22.99,30.02 22.67,29.37 | 22.99,30.02 23.31,29.37 | 22.99,30.02 22.67,29.37 | S1.11 22.67,29.37 | 22.99,30.02 23.31,29.37 | S1.11 23.31,29.37 | 28.07,30.02 | 28.07,30.02 27.75,29.37 | S1.13 27.75,29.37 | 28.07,30.02 | 28.07,30.02 28.39,29.37 | 28.39,29.37 | 28.07,30.02 | 28.07,30.02 | 28.07,30.02 28.39,29.37 | S1.13 28.39,29.37 | 28.07,30.02 27.75,29.37 | 28.07,30.02 27.75,29.37 | 27.75,29.37 | 28.07,30.02 27.75,29.37 | S1.13 27.75,29.37 | 28.07,30.02 28.39,29.37 | 28.39,29.37
  Top 0.508: S1.13 28.39,29.37 | 28.07,30.02 27.75,29.37 | 28.07,30.02 28.39,29.37 | 28.07,30.02 27.75,29.37 | S1.13 27.75,29.37 | 28.07,30.02 28.39,29.37 | S1.13 28.39,29.37
FT-POWERLED
  Top 0.254: FT-POWERLED.C 17.91,23.53 FT232-R3.2
FT-RESET  (via drill 0.35, 0.5)
  Top 0.152: S1.15 33.96,29.21 34.87,29.21 S1.16
  Top 0.2: v33.22,23.76 33.15,23.83 33.15,24.28 | 33.15,24.28 33.15,28.4 S1.15 | 33.15,24.28 33,23.83 v33.22,23.76 | 33.15,24.28 33.41,23.89 v33.22,23.76
  Top 0.254: 27.52,19.73 27.52,19.4 v27.86,19.06 | IC5.6 27.52,19.73 | 27.52,19.73 27.58,19.03 v27.86,19.06 | 27.52,19.73 28.04,19.26 v27.86,19.06
  Top 0.305: 33.96,29.21 33.4,29.59 S1.15 33.4,28.83 33.96,29.21 | 34.87,29.21 35.43,28.83 S1.16 35.43,29.59 34.87,29.21
  Top 0.4: 33.15,28.4 33.5,29 S1.15 32.79,29 33.15,28.4
  Bottom 0.2: 33.15,20.64 33.22,20.71 33.22,23.24 | 33.22,23.24 v33.22,23.76 | 33.22,23.24 33.42,23.66 v33.22,23.76 | 33.22,23.24 33.01,23.66 v33.22,23.76
  Bottom 0.254: 33.15,20.64 31.53,19.02 28.61,19.02 | 28.61,19.02 27.89,19.02 v27.86,19.06 | 28.61,19.02 27.97,19.31 v27.86,19.06 | 28.61,19.02 27.95,18.8 v27.86,19.06
GND  (via drill 0.35, 0.5, 0.6, 0.8)
  Top 0.2: FT232USBCON.M3 FT232USBCON.M2 FT232USBCON.M1 24.72,4.45 28.07,4.45 | 25.38,10.15 24.53,10.15 FT232USBCON.M4 20.88,9.25 FT232USBCON.5 | 25.38,10.15 25.95,10.15 25.94,10.15 | 25.94,10.15 v25.91,10.15 | FT232-R2.1 27.93,10.15 26.43,10.15 | 26.43,10.15 25.94,10.15 | 25.38,10.15 25.81,9.94 v25.91,10.15 | 25.38,10.15 25.81,10.35 v25.91,10.15 | 26.43,10.15 26.01,10.35 v25.91,10.15 | 26.43,10.15 26.01,9.94 v25.91,10.15
  Top 0.203: JTAG.2 56.35,76.41 | 56.35,76.41 56.02,76.41 56.01,76.42 v55.83,76.42 | JTAG.10 61.95,78.58 60.94,79.6 59.3,79.6 58.11,79.6 VOLTAGE-METER.P$2 | 56.35,76.41 55.93,76.62 v55.83,76.42 | 56.35,76.41 55.92,76.22 v55.83,76.42
  Top 0.254: 44.18,78.46 arc90 MEGA2-C1.2 | MEGA1-C1.1 44.18,58.42 | RESET-MEGA2.4 12.83,53.4 | 24.26,15.41 IC5.18 24.27,16.43 | IC5.21 26.16,15.48 26.16,17.14 | 26.87,17.85 26.87,17.94 | 26.87,17.94 26.87,20.95 | 26.87,20.95 IC5.7 | IC5.25 IC5.26 29.47,17.01 28.7,17.78 27.77,17.78 | 27.77,17.78 26.94,17.78 26.87,17.85 | FT232-R3.1 19.52,22.52 21.08,20.95 26.87,20.95 | FT232-R5.1 FT232-R4.1 30.46,2.06 28.07,4.45 28.07,10.04 FT232-R2.1 | MEGA1.3 43.31,65.63 | 44.18,72.56 44.18,72.16 | MEGA1.5 44.98,65.17 | MEGA2.3 43.39,46.52 | 24.27,16.43 24.27,16.98 v24.44,17.16 | 26.16,17.14 26.49,17.48 | 26.49,17.48 26.87,17.85 | 26.16,17.14 26.16,17.16 26.17,17.16 26.5,17.49 | 26.5,17.49 26.85,17.84 | 44.06,53.87 44.18,53.98 | U1.93 69.1,66.81 | 69.1,66.81 v69.1,66.06 | U1.73 81.02,64.69 81.38,65.06 | U1.53 78.33,54.69 | 78.33,54.69 77.97,54.69 v77.65,55 | U1.43 74.1,52.51 | 74.1,52.51 74.1,53.24 v74.08,53.26 | U1.63 79.58,59.71 79.56,59.7 78.14,59.7 77.73,59.29 77.73,59.15 | 77.73,59.15 v77.73,58.4 | U1.23 62.8,54.69 | 62.8,54.69 62.29,54.69 v62.08,54.48 | U1.3 63.62,64.67 64.67,64.67 | 64.67,64.67 v65.42,64.67 | U1.13 63.64,59.65 63.69,59.7 64.67,59.7 | U1.33 69.09,53.04 68.88,53.26 | 68.88,53.26 68.73,53.4 v68.14,53.4 | U1.84 73.61,67.68 73.61,66.54 73.53,66.46 | 73.53,66.46 73.24,66.17 v72.83,66.17 | v81.91,65.59 81.38,65.06 | 64.67,59.7 65,59.7 65.3,60 v65.3,60.1 | 43.61,67.19 | v43.31,67.31 43.61,67.19 | 43.31,66.41 43,67.19 | 43.31,66.41 43.61,67.19 | 43.61,67.19 | 43.31,66.41 43.61,67.19 | v43.31,67.31 43.61,67.19 | v43.31,67.31 43,67.19 | 43.31,66.41 43.61,67.19 | 43.31,66.41 43,67.19 | v43.31,67.31 43,67.19 | 43.31,66.41 43.61,67.19 | v43.31,67.31 43.61,67.19
  Top 0.254: 43.31,66.41 43,67.19 | v43.31,67.31 43,67.19 | 44.25,71.73 v44.58,71.75 44.8,72 | 24.27,16.43 24.67,17 v24.44,17.16 | 24.27,16.43 24.17,17.12 v24.44,17.16 | 69.1,66.81 68.84,66.17 | v69.1,66.06 68.84,66.17 | 69.1,66.81 69.36,66.17 | v69.1,66.06 69.36,66.17 | 69.1,66.81 68.84,66.17 | 69.1,66.81 69.36,66.17 | 69.1,66.81 68.84,66.17 | v69.1,66.06 68.84,66.17 | 69.1,66.81 69.36,66.17 | v69.1,66.06 69.36,66.17 | 78.33,54.69 77.85,55.19 v77.65,55 | 78.33,54.69 77.64,54.73 v77.65,55 | v74.08,53.26 74.34,53.16 | 74.1,52.51 73.82,53.15 v74.08,53.26 | 77.73,59.15 77.47,58.5 | v77.73,58.4 77.47,58.5 | 77.73,59.15 77.99,58.5 | v77.73,58.4 77.99,58.5 | 77.73,59.15 77.47,58.5 | 77.73,59.15 77.99,58.5 | 77.73,59.15 77.47,58.5 | v77.73,58.4 77.47,58.5 | 77.73,59.15 77.99,58.5 | v77.73,58.4 77.99,58.5 | 62.8,54.69 62.1,54.76 v62.08,54.48 | 62.8,54.69 62.25,54.27 v62.08,54.48 | 64.67,64.67 65.32,64.41 | v65.42,64.67 65.32,64.41 | 64.67,64.67 65.32,64.92 | v65.42,64.67 65.32,64.92 | 64.67,64.67 65.32,64.41 | 64.67,64.67 65.32,64.92 | 64.67,64.67 65.32,64.41 | v65.42,64.67 65.32,64.41 | 64.67,64.67 65.32,64.92 | v65.42,64.67 65.32,64.92 | 68.88,53.26 68.29,53.63 | v68.14,53.4 68.29,53.63 | 68.88,53.26 68.19,53.13 | v68.14,53.4 68.19,53.13 | 68.88,53.26 68.29,53.63 | v68.14,53.4 68.29,53.63 | 68.88,53.26 68.19,53.13 | v68.14,53.4 68.19,53.13 | 73.53,66.46 | 73.53,66.46 72.83,66.45 | 72.83,66.45 | v72.83,66.17 72.83,66.45 | 73.53,66.46 73.03,65.97 | 73.03,65.97 | v72.83,66.17 73.03,65.97 | 73.53,66.46 72.83,66.45 | v72.83,66.17 72.83,66.45 | 73.53,66.46 73.03,65.97 | v72.83,66.17 73.03,65.97 | 81.38,65.06 82.02,65.34 v81.91,65.59 | 81.38,65.06 81.66,65.7 v81.91,65.59 | 26.87,17.94 26.94,17.24 v27.22,17.27
  Top 0.254: 26.87,17.94 27.4,17.48 v27.22,17.27 | 27.77,17.78 27.12,17.53 v27.22,17.27 | 27.77,17.78 27.46,17.15 v27.22,17.27 | 26.49,17.48 27.05,17.05 v27.22,17.27 | 26.49,17.48 27.19,17.55 v27.22,17.27 | 26.5,17.49 27.05,17.06 v27.22,17.27 | 26.5,17.49 27.19,17.55 v27.22,17.27 | 64.67,59.7 65.36,59.83 v65.3,60.1 | 64.67,59.7 65.08,60.26 v65.3,60.1
  Top 0.305: 26.17,17.16 26.28,17.27 26.47,17.27 | 26.47,17.27 v27.22,17.27 | 26.47,17.27 27.13,17.04 | v27.22,17.27 27.13,17.04 | 26.47,17.27 27.13,17.51 | v27.22,17.27 27.13,17.51 | 26.47,17.27 27.13,17.04 | 26.47,17.27 27.13,17.51 | 26.47,17.27 27.13,17.04 | v27.22,17.27 27.13,17.04 | 26.47,17.27 27.13,17.51 | v27.22,17.27 27.13,17.51
  Top 0.406: 44.18,78.46 MEGA1.21 44.18,72.56 | 44.18,58.42 MEGA2.21 44.18,53.98 | 43.31,65.63 43.31,66.41 | 43.31,66.41 | 43.31,66.41 v43.31,67.31 | 44.18,72.16 v44.58,71.75 | 43.31,66.41 43.61,67.19 | 43.31,66.41 43,67.19 | 43,67.19 | 43,67.19 | 44.18,72.56 44.25,71.73 | 44.18,72.56 44.8,72 | 43.39,46.52 43.39,49.63 41.66,51.37 41.66,52.57 42.95,53.87 44.06,53.87 | MEGA2.3 | MEGA2.3 43.38,45.52 43.64,45.26 44.64,45.26 44.98,45.59 MEGA2.5 | 12.28,25.72 PAD2.1 12.29,21.6 GND-CHK.1 | MEGA1.3 43.38,64.83 arc90 43.75,64.46 44.7,64.46 arc90 44.98,64.73 MEGA1.5 | 43.31,66.41 43.55,67.24 | 43.31,66.41 43.07,67.24 | 43.07,67.24 | v43.31,67.31 43.07,67.24 | XMEGA-C1.2 63.88,68.92 64.55,69.59 | 64.55,69.59 v64.92,69.96 | 43.55,67.24 | 43.31,66.41 43.55,67.24 | 43.31,66.41 | 43.31,66.41 43.07,67.24 | 43.31,66.41 43.55,67.24 | v43.31,67.31 43.55,67.24 | 43.31,66.41 43.07,67.24 | v43.31,67.31 43.07,67.24 | 43.31,66.41 43.55,67.24 | v43.31,67.31 43.55,67.24 | 43.31,66.41 43.07,67.24 | v43.31,67.31 43.07,67.24 | 44.18,72.56 44.33,71.71 v44.58,71.75 | 44.18,72.56 44.76,71.92 v44.58,71.75 | 64.55,69.59 64.99,69.85 v64.92,69.96 | 64.55,69.59 64.82,70.02 v64.92,69.96 | 44.98,65.17 | 59.3,79.6 58.5,80.16 VOLTAGE-METER.P$2 58.51,79.02 59.3,79.6
  Top 0.813: v42.67,58.42 MEGA1-C1.1 | 12.29,21.6 11.78,21.04 GND-CHK.1 12.78,21.03 12.29,21.6
  Top 1.016: 108.47,52.46 108.47,49.32 SW6-R.1 | 108.47,52.46 v109.32,52.46 | SW7-R.1 108.47,52.46 | PING4.1 PING3.1 | PING1.1 PING0.1
  Top 1.27: 5C14.2 5C15.2 30.52,96.2 5C16.- 30.2,96.46 POWER-LED.C 17.41,91.92 X1.2 | 5C13.2 5C12.2 52.11,96.52 5C11.- | 3.3C6.- 63.77,96.2 3.3C5.2 3.3C4.2 | 3.3C3.2 3.3C2.2 85.36,96.52 3.3C1.-
  Bottom 0.203: 55.35,76.44 55.36,76.42 v55.83,76.42
  Bottom 0.254: v69.1,66.06 69.09,66.06 69.09,65.81 | v77.65,55 77.62,55 77.41,55.22 | v74.08,53.26 74.08,53.42 74.1,53.44 | 78.29,59.14 78.3,59.12 | v77.73,58.4 77.74,58.38 77.74,58 | v62.08,54.48 61.89,54.48 61.85,54.44 | v65.42,64.67 65.45,64.64 65.85,64.64 | v68.14,53.4 v68.13,53.4 67.69,53.4 | v72.83,66.17 72.47,66.17 | v81.91,65.59 81.91,66.23 81.93,66.25 | v65.3,60.1 65.32,60.12 65.32,60.78
  Bottom 0.305: v27.22,17.27 27.23,17.26 27.62,17.26
  Bottom 0.813: Q1.2 45.21,62.23 42.67,59.69 v42.67,58.42
  Bottom 1.016: Q2.2 45.84,40.17 | v109.32,52.46 109.32,52.49 110.05,52.49
  pour Bottom: 0.13,99.06 129.03,99.06 129.03,-0.64 0.1,-0.08
INA
  Top 0.254: FALLING.2 73.1,75.02 U1.85
INB
  Top 0.254: FALLING.3 72.6,77.06 U1.86
L6480_STBY  (via drill 0.35)
  Top 0.2: U1.36 70.6,45.14 72.38,43.36 72.41,43.36 | 72.41,43.36 72.43,43.34 | L6480.10 77.62,43.34 76.51,43.34 | 76.51,43.34 76,43.34 v75.98,43.36 | v73.69,43.36 73.17,43.36 | 73.17,43.36 72.41,43.36 | 76.51,43.34 76.09,43.56 v75.98,43.36 | 76.51,43.34 76.07,43.15 v75.98,43.36 | 73.17,43.36 73.59,43.15 v73.69,43.36 | 73.17,43.36 73.59,43.56 v73.69,43.36
  Top 0.4: 77.62,43.34 78.32,42.87 L6480.10 78.32,43.81 77.62,43.34
  Bottom 0.2: v75.98,43.36 75.46,43.36 | 75.46,43.36 74.22,43.36 | 74.22,43.36 v73.69,43.36 | 75.46,43.36 75.89,43.15 v75.98,43.36 | 75.46,43.36 75.89,43.56 v75.98,43.36 | 74.22,43.36 73.79,43.56 v73.69,43.36 | 74.22,43.36 73.79,43.15 v73.69,43.36
M1CS
  Top 0.2: 27.43,60.96 26.77,61.62 SS-2.2
  Top 0.254: MEGA2.25 36.06,53.6 31.24,58.42 28.07,58.42 27.43,59.05 27.43,60.96 28.38,61.9 28.7,62.23 MOTORDRIVER.6
  Top 0.508: 28.38,61.9 29.24,61.73 MOTORDRIVER.6 28.95,62.56 28.38,61.9
M1EN
  Top 0.254: MEGA2.28 30.21,51.2 30.05,51.35 MOTORDRIVER.10
  Top 0.508: 30.05,51.35 29.83,52.2 MOTORDRIVER.10 29.21,51.58 30.05,51.35
M1INA
  Top 0.254: MEGA2.27 33.22,52 30.61,54.61 30.35,54.61 MOTORDRIVER.9
  Top 0.508: 29.59,54.17 | 29.59,55.05 | 29.59,55.05 | 30.35,54.61 29.59,55.05 | 29.59,55.05 | 29.59,54.17 | 30.35,54.61 29.59,55.05 | 29.59,55.05 | 30.35,54.61 | 30.35,54.61 29.59,54.17 | 29.59,54.17 | 30.35,54.61 | 30.35,54.61 29.59,55.05 | MOTORDRIVER.9 29.59,55.05 | 30.35,54.61 | 30.35,54.61 29.59,54.17 | 29.59,54.17 | 29.59,54.17 | 30.35,54.61 29.59,55.05 | MOTORDRIVER.9 29.59,55.05 | 30.35,54.61 | 30.35,54.61 29.59,54.17 | MOTORDRIVER.9 29.59,54.17 | 30.35,54.61 29.59,54.17 | 29.59,54.17 | 30.35,54.61 29.59,55.05 | 29.59,55.05 | MOTORDRIVER.9 29.59,55.05 | 30.35,54.61 29.59,54.17 | MOTORDRIVER.9 29.59,54.17 | 30.35,54.61 29.59,55.05 | MOTORDRIVER.9 29.59,55.05 | 30.35,54.61 29.59,54.17 | MOTORDRIVER.9 29.59,54.17
M1INB
  Top 0.254: MEGA2.26 40.19,52.7 34.42,52.7 30.3,56.82 29.97,57.15 MOTORDRIVER.8
  Top 0.508: 30.3,56.82 29.72,57.48 MOTORDRIVER.8 29.44,56.65 30.3,56.82
M1PWM  (via drill 0.5, 0.6)
  Top 0.254: MEGA2.10 48.78,48.9 46.48,48.9 45.03,50.35 | MOTORDRIVER.7 30.35,59.69 36.32,59.69 37.59,58.42 | v38.23,57.78 37.59,58.42 | v44.49,50.88 v44.5,50.88 45.03,50.35 | 37.59,58.42 37.93,57.65 v38.23,57.78 | 37.59,58.42 38.36,58.08 v38.23,57.78 | 45.03,50.35 44.75,50.99 v44.49,50.88 | 45.03,50.35 44.39,50.62 v44.49,50.88
  Top 0.508: 29.59,59.25 | 29.59,60.13 | 29.59,60.13 | 30.35,59.69 29.59,60.13 | 29.59,60.13 | 29.59,59.25 | 30.35,59.69 29.59,60.13 | 29.59,60.13 | 30.35,59.69 | 30.35,59.69 29.59,59.25 | 29.59,59.25 | 30.35,59.69 | 30.35,59.69 29.59,60.13 | MOTORDRIVER.7 29.59,60.13 | 30.35,59.69 | 30.35,59.69 29.59,59.25 | 29.59,59.25 | 29.59,59.25 | 30.35,59.69 29.59,60.13 | MOTORDRIVER.7 29.59,60.13 | 30.35,59.69 | 30.35,59.69 29.59,59.25 | MOTORDRIVER.7 29.59,59.25 | 30.35,59.69 29.59,59.25 | 29.59,59.25 | 30.35,59.69 29.59,60.13 | 29.59,60.13 | MOTORDRIVER.7 29.59,60.13 | 30.35,59.69 29.59,59.25 | MOTORDRIVER.7 29.59,59.25 | 30.35,59.69 29.59,60.13 | MOTORDRIVER.7 29.59,60.13 | 30.35,59.69 29.59,59.25 | MOTORDRIVER.7 29.59,59.25
  Bottom 0.254: 38.46,56.92 42.67,52.71 42.67,52.7 43.96,51.41 | 38.46,56.92 38.23,57.15 v38.23,57.78 | 38.46,56.92 | 38.46,56.92 38.55,57.75 | v38.23,57.78 38.55,57.75 | 38.46,56.92 | 38.46,56.92 37.97,57.59 v38.23,57.78 | 38.55,57.75 | 38.46,56.92 38.55,57.75 | v38.23,57.78 38.55,57.75 | 38.46,56.92 37.97,57.59 | v38.23,57.78 37.97,57.59 | v44.49,50.88 43.96,51.41 | 38.46,56.92 38.55,57.75 | v38.23,57.78 38.55,57.75 | 38.46,56.92 37.97,57.59 | v38.23,57.78 37.97,57.59 | 43.96,51.41 44.24,50.77 v44.49,50.88 | 43.96,51.41 44.6,51.13 v44.49,50.88
M2CS
  Top 0.254: MEGA1.25 35.43,72.65 33.15,74.93 30.35,74.93 MOTORDRIVER.1 29.23,74.82 28.33,74.82 SS-1.2
  Top 0.508: 29.59,74.49 | 29.59,75.37 | 29.59,75.37 | 30.35,74.93 29.59,75.37 | 29.59,75.37 | 29.59,74.49 | 30.35,74.93 29.59,75.37 | 29.59,75.37 | 30.35,74.93 | 30.35,74.93 29.59,74.49 | 29.59,74.49 | 30.35,74.93 | 30.35,74.93 29.59,75.37 | MOTORDRIVER.1 29.59,75.37 | 30.35,74.93 | 30.35,74.93 29.59,74.49 | 29.59,74.49 | 29.59,74.49 | 30.35,74.93 29.59,75.37 | MOTORDRIVER.1 29.59,75.37 | 30.35,74.93 | 30.35,74.93 29.59,74.49 | MOTORDRIVER.1 29.59,74.49 | 30.35,74.93 29.59,74.49 | 29.59,74.49 | 30.35,74.93 29.59,75.37 | 29.59,75.37 | MOTORDRIVER.1 29.59,75.37 | 30.35,74.93 29.59,74.49 | MOTORDRIVER.1 29.59,74.49 | 30.35,74.93 29.59,75.37 | MOTORDRIVER.1 29.59,75.37 | 30.35,74.93 29.59,74.49 | MOTORDRIVER.1 29.59,74.49 | MOTORDRIVER.1 29.13,74.47 28.33,74.82 29.04,75.34 MOTORDRIVER.1
M2EN
  Top 0.254: MEGA1.28 38.63,70.25 33.15,64.77 30.35,64.77 MOTORDRIVER.5
  Top 0.508: 29.59,64.33 | 29.59,65.21 | 29.59,65.21 | 30.35,64.77 29.59,65.21 | 29.59,65.21 | 29.59,64.33 | 30.35,64.77 29.59,65.21 | 29.59,65.21 | 30.35,64.77 | 30.35,64.77 29.59,64.33 | 29.59,64.33 | 30.35,64.77 | 30.35,64.77 29.59,65.21 | MOTORDRIVER.5 29.59,65.21 | 30.35,64.77 | 30.35,64.77 29.59,64.33 | 29.59,64.33 | 29.59,64.33 | 30.35,64.77 29.59,65.21 | MOTORDRIVER.5 29.59,65.21 | 30.35,64.77 | 30.35,64.77 29.59,64.33 | MOTORDRIVER.5 29.59,64.33 | 30.35,64.77 29.59,64.33 | 29.59,64.33 | 30.35,64.77 29.59,65.21 | 29.59,65.21 | MOTORDRIVER.5 29.59,65.21 | 30.35,64.77 29.59,64.33 | MOTORDRIVER.5 29.59,64.33 | 30.35,64.77 29.59,65.21 | MOTORDRIVER.5 29.59,65.21 | 30.35,64.77 29.59,64.33 | MOTORDRIVER.5 29.59,64.33
M2INA
  Top 0.254: MEGA1.27 38.16,71.05 34.42,67.31 30.35,67.31 MOTORDRIVER.4
  Top 0.508: 29.59,66.87 | 29.59,67.75 | 29.59,67.75 | 30.35,67.31 29.59,67.75 | 29.59,67.75 | 29.59,66.87 | 30.35,67.31 29.59,67.75 | 29.59,67.75 | 30.35,67.31 | 30.35,67.31 29.59,66.87 | 29.59,66.87 | 30.35,67.31 | 30.35,67.31 29.59,67.75 | MOTORDRIVER.4 29.59,67.75 | 30.35,67.31 | 30.35,67.31 29.59,66.87 | 29.59,66.87 | 29.59,66.87 | 30.35,67.31 29.59,67.75 | MOTORDRIVER.4 29.59,67.75 | 30.35,67.31 | 30.35,67.31 29.59,66.87 | MOTORDRIVER.4 29.59,66.87 | 30.35,67.31 29.59,66.87 | 29.59,66.87 | 30.35,67.31 29.59,67.75 | 29.59,67.75 | MOTORDRIVER.4 29.59,67.75 | 30.35,67.31 29.59,66.87 | MOTORDRIVER.4 29.59,66.87 | 30.35,67.31 29.59,67.75 | MOTORDRIVER.4 29.59,67.75 | 30.35,67.31 29.59,66.87 | MOTORDRIVER.4 29.59,66.87
M2INB
  Top 0.254: MEGA1.26 37.05,71.85 35.05,69.85 30.35,69.85 MOTORDRIVER.3
  Top 0.508: 29.59,69.41 | 29.59,70.29 | 29.59,70.29 | 30.35,69.85 29.59,70.29 | 29.59,70.29 | 29.59,69.41 | 30.35,69.85 29.59,70.29 | 29.59,70.29 | 30.35,69.85 | 30.35,69.85 29.59,69.41 | 29.59,69.41 | 30.35,69.85 | 30.35,69.85 29.59,70.29 | MOTORDRIVER.3 29.59,70.29 | 30.35,69.85 | 30.35,69.85 29.59,69.41 | 29.59,69.41 | 29.59,69.41 | 30.35,69.85 29.59,70.29 | MOTORDRIVER.3 29.59,70.29 | 30.35,69.85 | 30.35,69.85 29.59,69.41 | MOTORDRIVER.3 29.59,69.41 | 30.35,69.85 29.59,69.41 | 29.59,69.41 | 30.35,69.85 29.59,70.29 | 29.59,70.29 | MOTORDRIVER.3 29.59,70.29 | 30.35,69.85 29.59,69.41 | MOTORDRIVER.3 29.59,69.41 | 30.35,69.85 29.59,70.29 | MOTORDRIVER.3 29.59,70.29 | 30.35,69.85 29.59,69.41 | MOTORDRIVER.3 29.59,69.41
M2PWM  (via drill 0.35)
  Top 0.2: MEGA1.10 47.02,67.85 46.75,68.11 | 46.75,68.11 46.51,68.36 46.51,68.4 v46.4,68.5 | 46.75,68.11 46.62,68.57 v46.4,68.5 | 46.75,68.11 46.31,68.29 v46.4,68.5
  Bottom 0.2: v46.4,68.5 46.18,68.5 45.93,68.75 | 45.93,68.75 40.36,74.32 33.66,74.32 31.74,72.4 30.35,72.4 MOTORDRIVER.2 | 45.93,68.75 46.22,68.37 v46.4,68.5 | 45.93,68.75 46.41,68.73 v46.4,68.5
  Bottom 0.4: 30.35,72.4 29.64,72.86 MOTORDRIVER.2 29.65,71.92 30.35,72.4
M_PWM  (via drill 0.6)
  Top 0.254: U1.35 70.1,52.97 70.36,53.22 | 70.36,53.22 70.43,53.3 71.15,53.3 v71.24,53.39 | v78.02,74.12 78.66,74.76 | 78.66,74.76 79.52,75.62 FALLING.1 | 70.36,53.22 71.18,53.07 v71.24,53.39 | 70.36,53.22 71.07,53.67 v71.24,53.39 | 78.66,74.76 77.89,74.42 v78.02,74.12 | 78.66,74.76 78.32,73.99 v78.02,74.12
  Bottom 0.254: v78.02,74.12 78.02,73.78 | v71.24,53.39 71.88,54.03 | 71.88,54.03 71.93,54.08 71.93,69.74 76.31,74.12 77.12,74.12 | 77.12,74.12 v78.02,74.12 | 71.88,54.03 71.11,53.69 v71.24,53.39 | 71.88,54.03 71.54,53.26 v71.24,53.39 | 77.12,74.12 77.91,73.82 v78.02,74.12 | 77.12,74.12 77.91,74.43 v78.02,74.12
MISO  (via drill 0.35)
  Top 0.2: SPI-SW1.2 51,54.36 50.24,53.6 MEGA2.16 | MEGA1.16 51.16,72.65 52.93,70.88 52.93,59.5 | 52.93,59.5 v52.93,58.98 | v24.26,24.7 24.26,24.17 | 24.26,24.17 IC5.11 | 52.93,59.5 52.73,59.08 v52.93,58.98 | 52.93,59.5 53.14,59.08 v52.93,58.98 | 24.26,24.17 24.46,24.6 v24.26,24.7 | 24.26,24.17 24.05,24.6 v24.26,24.7
  Top 0.4: 51,54.36 51.68,54.54 SPI-SW1.2 51.18,55.04 51,54.36
  Bottom 0.2: v52.93,58.98 52.93,58.45 | 52.93,58.45 52.93,56.29 52.15,55.51 SPI-SW1.2 51.55,54.93 50.99,54.37 50.86,54.25 50.86,54.2 50.69,54.03 50.69,34.06 44.2,27.57 27.71,27.57 24.66,25.03 | 24.66,25.03 v24.26,24.7 | 52.93,58.45 53.14,58.88 v52.93,58.98 | 52.93,58.45 52.73,58.88 v52.93,58.98 | 24.66,25.03 24.2,24.92 v24.26,24.7 | 24.66,25.03 24.46,24.6 v24.26,24.7
  Bottom 0.4: SPI-SW1.2 51.47,55.33 52.15,55.51 51.97,54.83 SPI-SW1.2 | SPI-SW1.2 51.67,54.54 50.99,54.37 51.18,55.05 SPI-SW1.2
MISO-X
  Top 0.2: U1.21 59.95,55.69 59.77,55.51 SPI-SW1.5
  Top 0.254: 63.56,55.65 U1.21
  Top 0.4: 59.77,55.51 59.09,55.33 SPI-SW1.5 59.59,54.83 59.77,55.51
MISO_E
  Top 0.2: U1.41 73.11,51.67 73.11,46.31 75.04,44.39 84.4,44.39 85.38,45.36 85.89,45.88 L6480.3 86.97,45.16 87.5,44.63 87.5,42.08 87.44,42.08 84.55,39.19 83.45,39.19 82.57,38.31 82.57,31.43 85.28,28.71 85.44,28.71 | 85.44,28.71 85.44,28.96 | 85.44,28.71 MPU9250.5
  Top 0.4: L6480.3 86.22,45.32 85.38,45.36 85.75,46.12 L6480.3 | L6480.3 86.8,45.99 86.97,45.16 86.14,45.33 L6480.3
MISO_F
  Top 0.2: GNSSSPI.3 115.33,56.21 113.28,54.15 113.28,49.91 110.04,46.67 94.11,46.67 91.08,49.7 84.59,49.7 80.6,53.69 79.61,53.69 U1.51
MISO_U
  Top 0.2: SPI4.2 107.07,62.5 109.05,62.5 111.23,64.69 119.61,64.69 120.83,63.47 120.83,41.52 119.96,40.65 LCD.1 113.48,39.69 114.78,39.69 115.58,38.89 115.58,35.4 114.49,34.3 110.42,34.3 100.3,24.19 75.13,24.19 72.25,27.07 72.25,37.81 68.1,41.96 U1.31
  Top 1.016: SPI4.2 SPI5.2 SPI6.2 SPI7.2
MOSI  (via drill 0.35)
  Top 0.2: 51.65,57.47 SPI-SW1.1 | 51.65,57.47 52.3,57.47 52.38,57.4 53.62,56.16 53.62,52.45 52.38,51.19 51.43,51.19 | 51.43,51.19 50.74,51.19 50.4,51.53 50.4,52.67 50.27,52.81 49.12,52.81 MEGA2.15 | 48.94,52.73 48.92,52.74 | MEGA1.15 50.68,71.85 51.68,70.85 51.68,58.28 51.68,57.5 51.65,57.47 | v25.64,24.99 25.27,24.62 | 25.27,24.62 24.92,24.26 IC5.10 | v51.43,50.13 v51.43,50.14 51.43,50.66 | 51.43,50.66 51.43,51.19 | 25.27,24.62 25.72,24.77 v25.64,24.99 | 25.27,24.62 25.43,25.06 v25.64,24.99 | 51.43,50.66 51.22,50.23 v51.43,50.13 | 51.43,50.66 51.63,50.23 v51.43,50.13
  Top 0.254: MEGA2.15 48.92,52.74 48.97,52.7
  Top 0.4: SPI-SW1.1 51.81,57.81 52.38,57.4 51.75,57.1 SPI-SW1.1 | SPI-SW1.1 51.25,57.73 51.68,58.28 51.95,57.63 SPI-SW1.1
  Bottom 0.2: 26.05,25.31 27.64,26.42 44,26.42 51.38,33.8 51.38,49.61 | 26.05,25.31 25.74,25.09 25.74,25.08 v25.64,24.99 | 51.42,50.06 51.43,50.07 v51.43,50.13 | v51.43,50.13 51.38,50.08 51.38,49.61 | 26.05,25.31 25.59,25.21 v25.64,24.99 | 26.05,25.31 25.84,24.89 v25.64,24.99 | 51.38,49.61 51.62,50.02 v51.43,50.13 | 51.38,49.61 51.22,50.05 v51.43,50.13
MOSI-X
  Top 0.2: U1.20 60.48,56.19 59.77,56.9 SPI-SW1.6
  Top 0.4: 59.77,56.9 59.59,57.58 SPI-SW1.6 59.09,57.08 59.77,56.9
MOSI_E
  Top 0.2: L6480.6 83.71,43.05 83.16,42.49 82.66,42 76.09,42 | 76.09,42 72.62,45.46 72.62,51.66 U1.40 | 76.09,42 76.1,41.99 76.1,36.22 82.9,29.42 MPU9250.4
  Top 0.4: 83.16,42.49 83.93,42.82 L6480.6 83.15,43.34 83.16,42.49
MOSI_F
  Top 0.2: U1.50 77.61,51.68 77.61,50.39 78.8,49.19 90.89,49.19 93.97,46.12 110.62,46.12 115.45,50.95 115.45,53.58 GNSSSPI.4 115.33,53.45
MOSI_U
  Top 0.2: SPI4.1 109.2,66 121.97,66 123.2,64.78 123.2,38.81 117.41,33.03 112.72,33.03 | 112.72,33.03 LCD.4 | 112.72,33.03 112.68,33.06 110.67,33.06 101.19,23.58 74.91,23.58 71.69,26.8 71.69,37.46 67.6,41.55 U1.30
  Top 1.016: SPI7.1 SPI6.1 SPI5.1 SPI4.1
N$2
  Top 0.254: RO1.P$3 20.89,57.34 21.27,56.97 26.16,52.07 26.16,49.53 27.43,48.26 31.24,48.26 32.51,46.99 39.27,46.99 MEGA2.32
  Top 0.508: 21.27,56.97 20.29,56.71 | 20.29,56.71 | 21.27,56.97 20.63,57.75 | 21.27,56.97 20.29,56.71 | RO1.P$3 20.29,56.71 | 21.27,56.97 20.29,56.71 | RO1.P$3 20.29,56.71 | 21.27,56.97 20.63,57.75 | RO1.P$3 20.63,57.75 | 21.27,56.97 20.29,56.71 | RO1.P$3 20.29,56.71
N$5
  Top 0.813: POWER-LEDR.1 25.36,90.05 POWER-LED.A
N$6
  Top 0.254: MEGA1.32 38.56,67.05 38.55,67.01 38.54,67 38.33,66.53 38.32,66.52 38.32,66.37 38.31,66.34 36.29,64.33 36.29,64.31 30.7,64.31 | 30.7,64.31 | 30.7,64.31 30.63,64.29 30.47,64.14 29.77,63.73 28.91,63.73 28.39,64.25 26.22,64.25 20.98,69.49 RO2.P$3
  Top 0.508: 20.98,69.49 20.76,70.48 RO2.P$3 19.99,69.71 20.98,69.49
N$7  (via drill 0.6)
  Top 0.61: v18.1,81.98 18.9,81.98 19,81.88 | 19,81.88 18.14,82.12 v18.1,81.98 | 19,81.88 18.11,81.83 v18.1,81.98
  Top 0.813: 19,81.88 M2-R2.2
  Top 1.676: SUPPLY.1 8.98,84.42 9.02,84.45 9.99,84.45 10.92,83.52
  Top 1.778: SUPPLY.1 3.67,84.39 | Q3.S 10.92,83.52 10.92,83.82 13.46,86.36 15.97,86.36 X1.1
  Bottom 0.61: X1.1 16.13,83.95 17.47,82.61 | 17.47,82.61 v18.1,81.98 | 17.47,82.61 17.98,81.89 v18.1,81.98 | 17.47,82.61 18.19,82.1 v18.1,81.98
N$8  (via drill 0.35)
  Top 0.152: U1.89 71.18,67.77 71.18,75.86 66.07,80.96 47.17,80.96 44.49,83.64 25.01,83.64 | 25.01,83.64 v24.49,83.64 | 25.01,83.64 24.61,83.86 v24.49,83.64 | 25.01,83.64 24.61,83.42 v24.49,83.64
  Bottom 0.152: v24.49,83.64 24.11,83.27 | 24.11,83.27 20.95,80.11 20.95,74.8 15.49,69.34 15.49,66.66 9.74,60.92 9.74,33.41 3.42,27.09 3.42,21.91 SV3.1 | 24.11,83.27 24.56,83.4 v24.49,83.64 | 24.11,83.27 24.24,83.71 v24.49,83.64
  Bottom 0.305: 3.42,21.91 2.98,21.31 SV3.1 3.85,21.31 3.42,21.91
N$9
  Top 0.254: IC5.15 FT232-R6.1
N$10
  Top 0.61: MEGA1.7 46.58,64.23 45.99,63.64 44.76,63.64 43.92,62.8 | 43.92,62.8 Q1.1 | 43.92,62.8 43.23,62.51 Q1.1 | 43.92,62.8 43.63,62.11 Q1.1
N$11
  Top 0.61: MEGA1.8 47.38,63.2 47.77,62.8 | 47.77,62.8 Q1.3 | 47.77,62.8 48.07,62.11 Q1.3 | 47.77,62.8 48.47,62.51 Q1.3
N$12
  Top 0.254: FT232USBCON.3 19.18,10.79 19.81,11.43 21.08,11.43 FT232-R6.2
N$14
  Top 0.254: IC5.16 22.99,15.44 22.99,17.14 22.35,17.78 21.08,17.78 19.18,15.88 FT232-R7.1
N$15
  Top 0.254: U1.98 66.57,67.71 L6.A
N$18  (via drill 0.6)
  Top 0.254: L6.C 66.58,73.03 | 66.58,73.03 66.58,73.5 66.53,73.55 v66.53,73.93 | 66.58,73.03 66.84,73.83 v66.53,73.93 | 66.58,73.03 66.23,73.8 v66.53,73.93
  Bottom 0.254: v66.53,73.93 66.55,73.95 66.55,74.83 | 66.55,74.83 TEST-R.2 | 66.55,74.83 66.23,74.06 v66.53,73.93 | 66.55,74.83 66.83,74.04 v66.53,73.93
N$20
  Top 0.61: MEGA2.7 46.58,45.18 46.48,45.09 45.76,45.09 43.92,43.25 | 43.92,43.25 Q2.1 | 43.92,43.25 43.23,42.95 Q2.1 | 43.92,43.25 43.63,42.55 Q2.1
N$23
  Top 0.254: FT232-R7.2 18.38,11.69 FT232USBCON.2
N$24
  Top 0.61: MEGA2.8 47.38,43.64 47.77,43.25 | 47.77,43.25 Q2.3 | 47.77,43.25 48.07,42.55 Q2.3 | 47.77,43.25 48.47,42.95 Q2.3
N$25